# EAGLE design max1811_ladowarka_prosta (EAGLE 6.3)
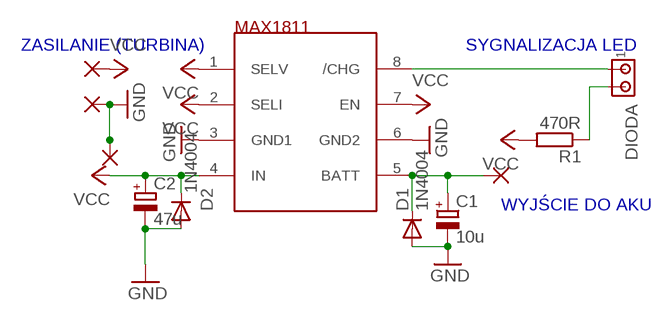
[diagram p0: schematic, sheet 1]

## Parts
BATERIA  1,6/0,9  [1,6/0,9]
C1  10u  CPOL-EUE2.5-6  [E2,5-6]
C2  47u  CPOL-EUE2.5-6  [E2,5-6]
D1  1N4004  [DO41-10]
D2  1N4004  [DO41-10]
DIODA  MTA02-100  [10X02MTA]
PAD2  1,6/0,9  [1,6/0,9]
PAD4  1,6/0,9  [1,6/0,9]
R1  470R  R-EU_R0805  [R0805]
U$1  MAX1811  [SO-08]
WEJ  1,6/0,9  [1,6/0,9]

## Nets
GND: C1.- C2.- D1.A D2.A PAD2.1(P) PAD4.1(P) U$1.3(GND1) U$1.6(GND2)
N$1: DIODA.1 U$1.8(/CHG)
N$2: DIODA.2 R1.1
N$3: BATERIA.1(P) C1.+ D1.C U$1.5(BATT)
VCC: C2.+ D2.C R1.2 U$1.1(SELV) U$1.2(SELI) U$1.4(IN) U$1.7(EN) WEJ.1(P)

## Notes on the sheet
- ZASILANIE (TURBINA) | SYGNALIZACJA LED
- WYJŚCIE DO AKU

## Library data of the parts
BATERIA PAD2 PAD4 WEJ = wirepad:1,6/0,9: THROUGH-HOLE PAD
C1 C2 = rcl:CPOL-EU: POLARIZED CAPACITOR, European symbol
D1 D2 = diode:1N4004: DIODE general purpose rectifier, 1 A
DIODA = con-amp:MTA02-100: AMP connector
R1 = rcl:R-EU_: RESISTOR, European symbol
U$1 = ref-packages:MAX1811

## Net classes
0 default: clearance 0.65 mm

## Board
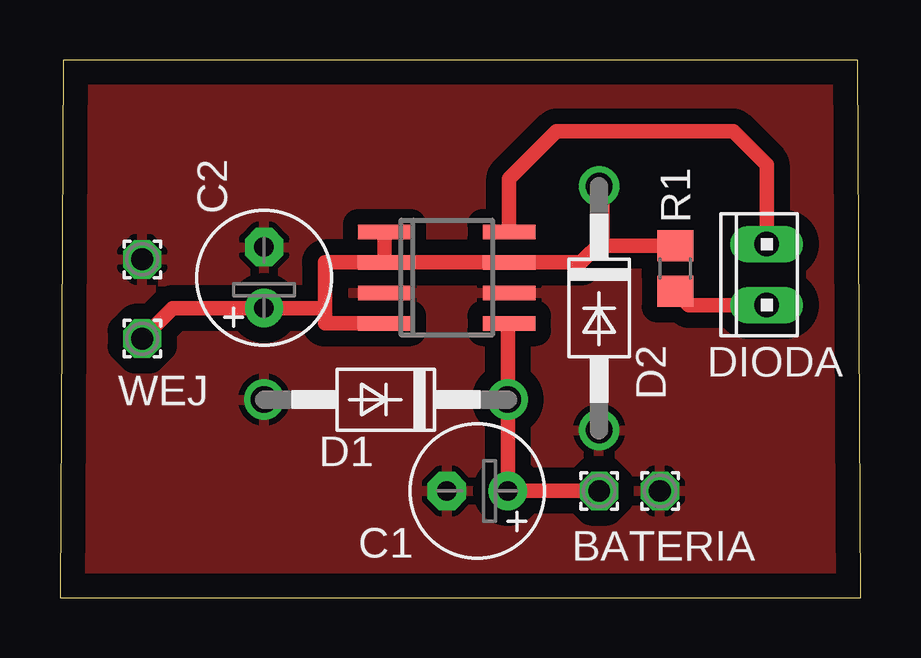
[diagram p1: board, top side]

Size 33.38 x 22.4 mm. Coordinates in mm from the lower left corner, seen from the top.
Outline: 0,0 33.38,0 33.25,22.4 0.13,22.4 0,0
Copper layers (1*16): Top 0.035mm / dielectric 1.5mm / Bottom 0.035mm
Design rules "default": minimum track width 10mil, minimum drill 24mil, track to track 8mil, track to pad 8mil, pad to pad 8mil, via to via 8mil, smd to smd 8mil, copper to edge 40mil, drill to drill 8mil, minimum pad ring 10mil, minimum via ring 8mil, stop-mask expansion 4mil, vias tented up to drill 0mil, thermal gap 10mil

### Footprints (pad centres in the part's own frame; a part is rotated, then mirrored left to right if it is on the bottom)
1,6/0,9 = drill 0.914 pad 1.6 octagon: 1 0,0
E2,5-6 = drill 0.813 pad 1.6: + -1.27,0 | drill 0.813 pad 1.6 octagon: - 1.27,0
DO41-10 = drill 1.118: A 5.08,0; C -5.08,0
10X02MTA = drill 1.016 long: 1 1.27,0; 2 -1.27,0
R0805 = smd 1.3 x 1.5: 1 -0.95,0; 2 0.95,0
SO-08 = smd 0.6 x 2.2: 1 -1.905,-2.6; 2 -0.635,-2.6; 3 0.635,-2.6; 4 1.905,-2.6; 5 1.905,2.6; 6 0.635,2.6; 7 -0.635,2.6; 8 -1.905,2.6

### Placement (x,y rotation side)
BATERIA  22.48,4.45 0 top
C1  17.4,4.45 180 top
C2  8.51,13.34 90 top
D1  13.59,8.26 180 top
D2  22.48,12.07 270 top
DIODA  29.46,13.46 90 top
PAD2  3.43,14.1 0 top
PAD4  25.02,4.45 0 top
R1  25.65,13.72 90 top
U$1  16.13,13.34 270 top
WEJ  3.43,10.8 0 top

### Tracks (layer width: path | path; a pad name or v marks a point on that pad's centre or on a via)
GND
  pour Top: -4.19,-5.71 47.88,-5.71 47.88,29.85 -4.19,29.85
N$1
  Top 0.61: U$1.8 18.73,17.46 20.7,19.43 28.07,19.43 29.46,18.03 DIODA.1
N$2
  Top 0.61: DIODA.2 26.23,12.19 R1.1
N$3
  Top 0.61: U$1.5 18.67,11.37 D1.C C1.+ BATERIA.1
VCC
  Top 0.61: U$1.2 11.05,13.97 11.05,12.07 | U$1.4 11.05,11.43 11.05,12.07 | U$1.2 U$1.1 | U$1.2 U$1.7 21.72,13.97 22.61,14.86 | 22.61,14.86 22.61,17.02 D2.C | R1.2 22.8,14.67 22.61,14.86 | 11.05,12.07 C2.+ 4.7,12.07 WEJ.1